# Altium schematic sheet Sheet1.SchDoc
size A4; SheetNumber: 1; SheetTotal: 1
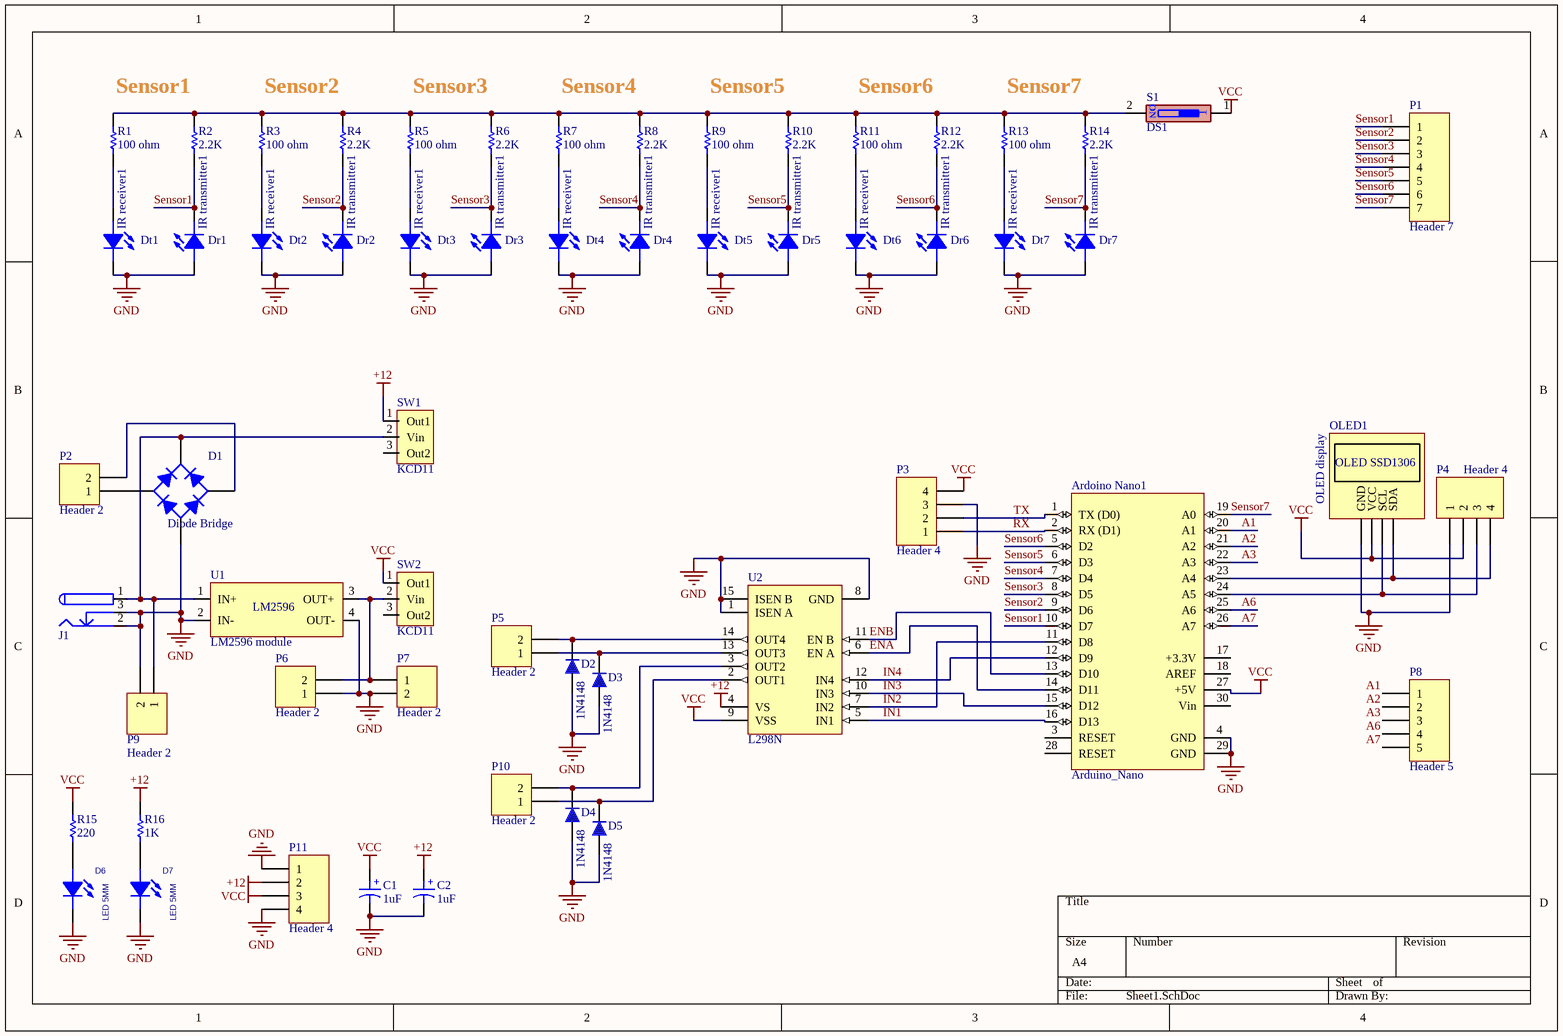
[diagram p0: Sheet1.SchDoc]

## Parts
Ardoino_Nano1  Arduino_Nano  [Arduino_Nano]
C1  1uF  [Cap electrolitic radial 10x16-5]
C2  1uF  [Cap electrolitic radial 10x16-5]
D1  Diode Bridge  [Bridge KBP PACKAGE]
D2  1N4148  [DO 35]
D3  1N4148  [DO 35]
D4  1N4148  [DO 35]
D5  1N4148  [DO 35]
D6  LED 5MM  [LED5MM_RED]
D7  LED 5MM  [LED5MM_RED]
Dr1  IR transmitter1  [LED3mm_GRN]
Dr2  IR transmitter1  [LED3mm_GRN]
Dr3  IR transmitter1  [LED3mm_GRN]
Dr4  IR transmitter1  [LED3mm_GRN]
Dr5  IR transmitter1  [LED3mm_GRN]
Dr6  IR transmitter1  [LED3mm_GRN]
Dr7  IR transmitter1  [LED3mm_GRN]
Dt1  IR receiver1  [LED3mm_GRN]
Dt2  IR receiver1  [LED3mm_GRN]
Dt3  IR receiver1  [LED3mm_GRN]
Dt4  IR receiver1  [LED3mm_GRN]
Dt5  IR receiver1  [LED3mm_GRN]
Dt6  IR receiver1  [LED3mm_GRN]
Dt7  IR receiver1  [LED3mm_GRN]
J1  DC Power Jack  [DC Power Jack 1]  (value not drawn)
OLED1  OLED display  [OLED-SSD1306]
P1  Header 7  [HDR1X7]
P2  Header 2  [HDR1X2]
P3  Header 4  [HDR1X4]
P4  Header 4  [HDR1X4]
P5  Header 2  [HDR1X2]
P6  Header 2  [HDR1X2]
P7  Header 2  [HDR1X2]
P8  Header 5  [HDR1X5]
P9  Header 2  [HDR1X2]
P10  Header 2  [HDR1X2]
P11  Header 4  [HDR1X4]
R1  100 ohm  [Axial 0_25 W, 0_4 IN LEAD PITCH]
R2  2.2K  [Axial 0_25 W, 0_4 IN LEAD PITCH]
R3  100 ohm  [Axial 0_25 W, 0_4 IN LEAD PITCH]
R4  2.2K  [Axial 0_25 W, 0_4 IN LEAD PITCH]
R5  100 ohm  [Axial 0_25 W, 0_4 IN LEAD PITCH]
R6  2.2K  [Axial 0_25 W, 0_4 IN LEAD PITCH]
R7  100 ohm  [Axial 0_25 W, 0_4 IN LEAD PITCH]
R8  2.2K  [Axial 0_25 W, 0_4 IN LEAD PITCH]
R9  100 ohm  [Axial 0_25 W, 0_4 IN LEAD PITCH]
R10  2.2K  [Axial 0_25 W, 0_4 IN LEAD PITCH]
R11  100 ohm  [Axial 0_25 W, 0_4 IN LEAD PITCH]
R12  2.2K  [Axial 0_25 W, 0_4 IN LEAD PITCH]
R13  100 ohm  [Axial 0_25 W, 0_4 IN LEAD PITCH]
R14  2.2K  [Axial 0_25 W, 0_4 IN LEAD PITCH]
R15  220  [Axial 0_25 W, 0_4 IN LEAD PITCH]
R16  1K  [Axial 0_25 W, 0_4 IN LEAD PITCH]
S1  DS1  [DIP Switch x1]
SW1  KCD11  [KCD11 rocker switch]
SW2  KCD11  [KCD11 rocker switch]
U1  LM2596 module  [LM2596 module]
U2  L298N  [Multiwatt15V]

## Nets
+12: C2.1 P11.2 R16.2 SW1.1(Out1) U2.4(VS)
GND: Ardoino_Nano1.4(GND) Ardoino_Nano1.29(GND) C1.2 C2.2 D1.4(-) D2.1 D3.1 D4.1 D5.1 D6.2(CATHODE) D7.2(CATHODE) Dr1.1(ANODE) Dr2.1(ANODE) Dr3.1(ANODE) Dr4.1(ANODE) Dr5.1(ANODE) Dr6.1(ANODE) Dr7.1(ANODE) Dt1.2(CATHODE) Dt2.2(CATHODE) Dt3.2(CATHODE) Dt4.2(CATHODE) Dt5.2(CATHODE) Dt6.2(CATHODE) Dt7.2(CATHODE) J1.2 J1.3 OLED1.GND P3.3 P4.1 P6.1 P7.2 P9.2 P11.1 P11.4 U1.2(IN-) U1.4(OUT-) U2.1(ISEN_A) U2.8(GND) U2.15(ISEN_B)
VCC: Ardoino_Nano1.27(+5V) C1.1 OLED1.VCC P3.4 P4.2 P11.3 R15.2 S1.1 SW2.1(Out1) U2.9(VSS)
A1: Ardoino_Nano1.20(A1) P8.1
A2: Ardoino_Nano1.21(A2) P8.2
A3: Ardoino_Nano1.22(A3) P8.3
A6: Ardoino_Nano1.25(A6) P8.4
A7: Ardoino_Nano1.26(A7) P8.5
ENA: Ardoino_Nano1.14(D11) U2.6(EN_A)
ENB: Ardoino_Nano1.13(D10) U2.11(EN_B)
IN1: Ardoino_Nano1.16(D13) U2.5(IN1)
IN2: Ardoino_Nano1.11(D8) U2.7(IN2)
IN3: Ardoino_Nano1.15(D12) U2.10(IN3)
IN4: Ardoino_Nano1.12(D9) U2.12(IN4)
RX: Ardoino_Nano1.2(RX_(D1)) P3.1
Sensor1: Ardoino_Nano1.10(D7) Dr1.2(CATHODE) P1.1 R2.1
Sensor2: Ardoino_Nano1.9(D6) Dr2.2(CATHODE) P1.2 R4.1
Sensor3: Ardoino_Nano1.8(D5) Dr3.2(CATHODE) P1.3 R6.1
Sensor4: Ardoino_Nano1.7(D4) Dr4.2(CATHODE) P1.4 R8.1
Sensor5: Ardoino_Nano1.6(D3) Dr5.2(CATHODE) P1.5 R10.1
Sensor6: Ardoino_Nano1.5(D2) Dr6.2(CATHODE) P1.6 R12.1
Sensor7: Ardoino_Nano1.19(A0) Dr7.2(CATHODE) P1.7 R14.1
TX: Ardoino_Nano1.1(TX_(D0)) P3.2
NetArdoino_Nano1_23: Ardoino_Nano1.23(A4) OLED1.SDA P4.4
NetArdoino_Nano1_24: Ardoino_Nano1.24(A5) OLED1.SCL P4.3
NetD1_1: D1.1(+) J1.1 P9.1 SW1.2(Vin) U1.1(IN+)
NetD1_2: D1.2(AC) P2.1
NetD1_3: D1.3(AC) P2.2
NetD2_2: D2.2 P5.2 U2.14(OUT4)
NetD3_2: D3.2 P5.1 U2.13(OUT3)
NetD4_2: D4.2 P10.2 U2.3(OUT2)
NetD5_2: D5.2 P10.1 U2.2(OUT1)
NetD6_1: D6.1(ANODE) R15.1
NetD7_1: D7.1(ANODE) R16.1
NetDt1_1: Dt1.1(ANODE) R1.1
NetDt2_1: Dt2.1(ANODE) R3.1
NetDt3_1: Dt3.1(ANODE) R5.1
NetDt4_1: Dt4.1(ANODE) R7.1
NetDt5_1: Dt5.1(ANODE) R9.1
NetDt6_1: Dt6.1(ANODE) R11.1
NetDt7_1: Dt7.1(ANODE) R13.1
NetP6_2: P6.2 P7.1 SW2.2(Vin) U1.3(OUT+)
NetR1_2: R1.2 R2.2 R3.2 R4.2 R5.2 R6.2 R7.2 R8.2 R9.2 R10.2 R11.2 R12.2 R13.2 R14.2 S1.2

Not connected (* = marked no-connect by the designer): Ardoino_Nano1 3(RESET) 17(+3.3V) 18(AREF) 28(RESET) 30(Vin); SW1 3(Out2); SW2 3(Out2)

## Notes on the sheet
- Sensor1
- Sensor2
- Sensor3
- Sensor4
- Sensor5
- Sensor6
- Sensor7
- (in symbol Cap ELECTROLITIC TOTAL SIZE) +
- (in symbol DIP Switch 1) ON
- (in symbol LM2596 module) LM2596
- (in symbol OLED-SSD1306) OLED SSD1306

## Library data of the parts
C1 C2 = Cap ELECTROLITIC TOTAL SIZE: Cap electrolitic radial; Designer: Abbas Basereh; Data: 16-12-2016; Part. No: *; VALUE: 1uF
D1 = Diode Bridge TOTAL SIZE: Full Wave Diode Bridge; Designer: Abbas Basereh; Design Date: 1395/11/09; ComponentLink1Description: Datasheet; ComponentLink2Description: Reference; Mounting Technology: Surface Mount\Through-Hole; Status: Unreleased
D2-D5 = 1N4148: DIODE GEN PURP 100V 200MA DO35; Published: 2017-1-12; PackageVersion: 2017-1-12; PackageReference: DO 35; Publisher: Abbas Basereh; PackageDescription: DIODE GEN PURP 100V 200MA DO35; ComponentLink1Description: Manufacturer Link; ComponentLink1URL: http://www.digikey.com/product-detail/en/fairchild-on-semiconductor/1N4148/1N4148FS-ND/458603; ComponentLink2Description: Datasheet; PART.NO: 1N4148
D6 D7 = LED 5MM: Light Emitting Diode; Designer: Abbas Basereh; Data: 16-12-2016; Link: *; Part.No: *
Dr1-Dr7 Dt1-Dt7 = LED 3MM: Light Emitting Diode; Designer: Ali Hafizi
J1 = DC Power Jack: DC Power Jack. Center Pin 2.5mm. Diameter: 5.7mm; Designer: Ali Hafizi; Company: Personal; Project Name: Laser; Adding Date: 10/21/2009
OLED1 = OLED-SSD1306: OLED display SSD1306 0.96 inch 64*128px
P1 = Header 7: Header, 7-Pin; LatestRevisionDate: 17-Jul-2002; LatestRevisionNote: Re-released for DXP Platform.; Publisher: Altium Limited
P2 P5-P7 P9 P10 = Header 2: Header, 2-Pin; LatestRevisionDate: 17-Jul-2002; LatestRevisionNote: Re-released for DXP Platform.; Publisher: Altium Limited
P3 P4 P11 = Header 4: Header, 4-Pin; LatestRevisionDate: 17-Jul-2002; LatestRevisionNote: Re-released for DXP Platform.; Publisher: Altium Limited
P8 = Header 5: Header, 5-Pin; LatestRevisionDate: 17-Jul-2002; LatestRevisionNote: Re-released for DXP Platform.; Publisher: Altium Limited
R1-R16 = RES Axial 0.25W: Designer: Abbas Basereh; Desc.: RES Axial 0.25W; Data: 4-1-2017
S1 = DIP Switch 1: 1 BIT DIP Switch
SW1 SW2 = KCD11: KCD11 rocker switch 2 state off/on
U1 = LM2596 module: LM2596 DC-DC module 1.25V-30V 3A
U2 = L298N: Dual Full Bridge Driver; Revision 1: 24-Aug-2001: Footprint Added.; Revision 2: 17-Jul-2002: Re-released for DXP Platform.; Package Information: Latest Revision: Apr-1998; Published: 8-Jun-2000; Datasheet: Latest Revision: Jul-1999; Package Reference: Multiwatt15H; Publisher: Altium Limited